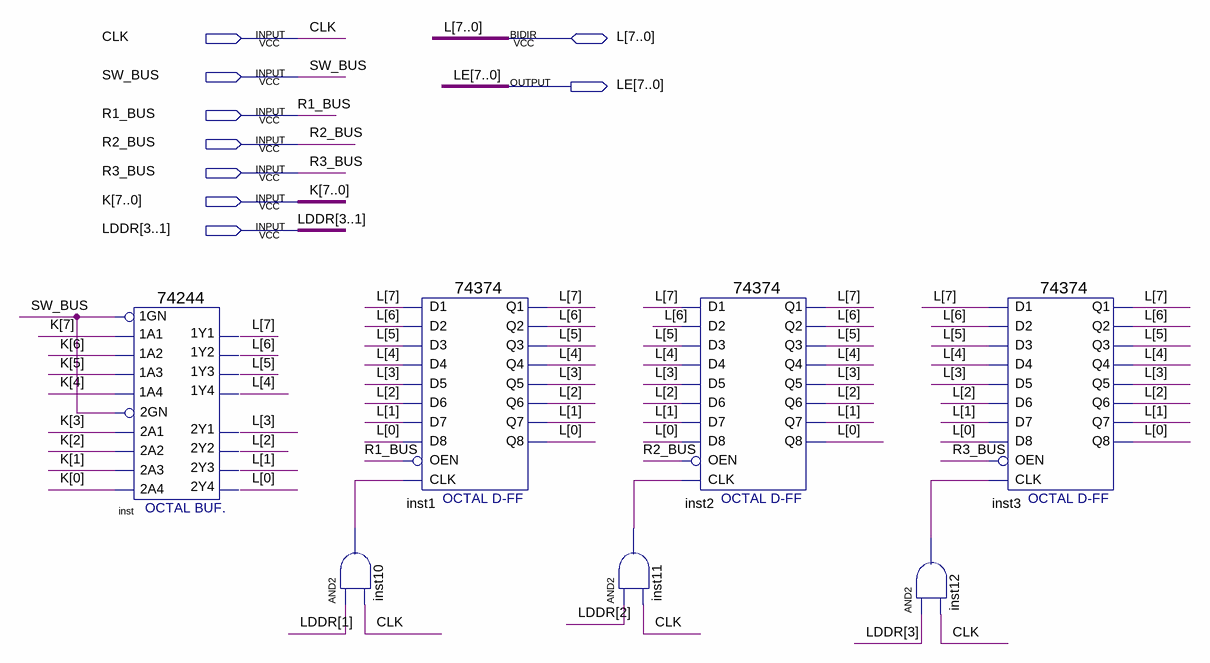
[diagram p0: schematic sheet]
// Quartus schematic zx.bdf as structural Verilog: 7 symbols, 9 pins
module zx (
  input  CLK,
  input  SW_BUS,
  input  R1_BUS,
  input  R2_BUS,
  input  R3_BUS,
  input  [7:0] K,
  input  [3:1] LDDR,
  inout  [7:0] L,
  output [7:0] LE
);

  wire inst10_out, inst11_out, inst12_out;

  \74244  inst (
    .\1A2 (K[6]), .\1A4 (K[4]), .\1A1 (K[7]), .\1A3 (K[5]), .\1GN (SW_BUS), .\2A3 (K[1]), .\2GN (SW_BUS),
    .\2A1 (K[3]), .\2A4 (K[0]), .\2A2 (K[2]), .\1Y2 (L[6]), .\1Y4 (L[4]), .\2Y1 (L[3]), .\1Y1 (L[7]),
    .\2Y3 (L[1]), .\2Y4 (L[0]), .\1Y3 (L[5]), .\2Y2 (L[2]));
  and inst10 (inst10_out, LDDR[1], CLK);
  \74374  inst1 (
    .D1(L[7]), .D2(L[6]), .D3(L[5]), .D4(L[4]), .D6(L[2]), .D5(L[3]), .OEN(R1_BUS), .D8(L[0]), .D7(L[1]),
    .CLK(inst10_out), .Q2(L[6]), .Q3(L[5]), .Q5(L[3]), .Q4(L[4]), .Q6(L[2]), .Q7(L[1]), .Q8(L[0]), .Q1(L[7]));
  and inst11 (inst11_out, LDDR[2], CLK);
  \74374  inst2 (
    .D1(L[7]), .D2(L[6]), .D3(L[5]), .D4(L[4]), .D6(L[2]), .D5(L[3]), .OEN(R2_BUS), .D8(L[0]), .D7(L[1]),
    .CLK(inst11_out), .Q2(L[6]), .Q3(L[5]), .Q5(L[3]), .Q4(L[4]), .Q6(L[2]), .Q7(L[1]), .Q8(L[0]), .Q1(L[7]));
  and inst12 (inst12_out, LDDR[3], CLK);
  \74374  inst3 (
    .D1(L[7]), .D2(L[6]), .D3(L[5]), .D4(L[4]), .D6(L[2]), .D5(L[3]), .OEN(R3_BUS), .D8(L[0]), .D7(L[1]),
    .CLK(inst12_out), .Q2(L[6]), .Q3(L[5]), .Q5(L[3]), .Q4(L[4]), .Q6(L[2]), .Q7(L[1]), .Q8(L[0]), .Q1(L[7]));
endmodule
